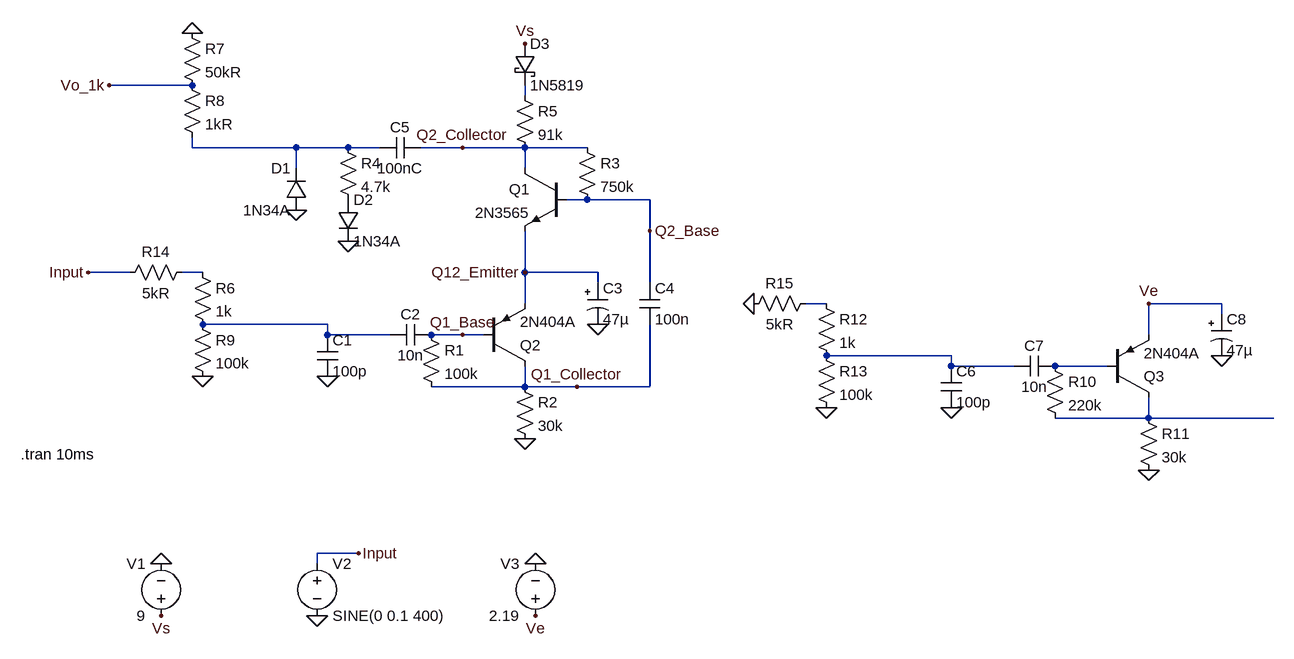
[diagram p0: schematic HarmonicPercolatorSine.asc]
HarmonicPercolatorSine.asc, the LTspice schematic file:
Version 4
SHEET 1 1720 1204
WIRE -48 -80 -176 -80
WIRE 464 -64 464 -80
WIRE -48 16 -48 0
WIRE 112 16 -48 16
WIRE 192 16 112 16
WIRE 240 16 192 16
WIRE 368 16 304 16
WIRE 464 16 368 16
WIRE 560 16 464 16
WIRE 112 48 112 16
WIRE 464 48 464 16
WIRE 560 96 528 96
WIRE 656 96 560 96
WIRE 656 144 656 96
WIRE -144 208 -208 208
WIRE -32 208 -64 208
WIRE 464 208 464 144
WIRE 576 208 464 208
WIRE 576 224 576 208
WIRE 656 224 656 144
WIRE 464 256 464 208
WIRE 928 256 896 256
WIRE 1536 256 1424 256
WIRE 1536 272 1536 256
WIRE 160 288 -32 288
WIRE 160 304 160 288
WIRE 256 304 160 304
WIRE 368 304 320 304
WIRE 400 304 368 304
WIRE 1424 304 1424 256
WIRE 1120 336 928 336
WIRE 1120 352 1120 336
WIRE 1216 352 1120 352
WIRE 1360 352 1280 352
WIRE 464 384 464 352
WIRE 464 384 320 384
WIRE 544 384 464 384
WIRE 656 384 656 288
WIRE 656 384 544 384
WIRE 1424 432 1424 400
WIRE 1424 432 1280 432
WIRE 1616 432 1424 432
WIRE 208 640 144 640
WIRE 144 656 144 640
FLAG 160 368 0
FLAG 464 464 0
FLAG 576 288 0
FLAG 192 160 0
FLAG 112 112 0
FLAG 368 304 Q1_Base
FLAG 544 384 Q1_Collector
FLAG 464 208 Q12_Emitter
FLAG 656 144 Q2_Base
FLAG 368 16 Q2_Collector
FLAG -96 656 0
FLAG -32 368 0
FLAG -48 -160 0
FLAG 144 736 0
FLAG 208 640 Input
FLAG -208 208 Input
FLAG -96 736 Vs
FLAG 464 -144 Vs
FLAG -176 -80 Vo_1k
FLAG 1120 416 0
FLAG 1424 512 0
FLAG 1536 336 0
FLAG 928 416 0
FLAG 480 656 0
FLAG 480 736 Ve
FLAG 1424 256 Ve
FLAG 816 256 0
SYMBOL cap 144 304 R0
SYMATTR InstName C1
SYMATTR Value 100p
SYMBOL cap 320 288 R90
WINDOW 0 0 32 VBottom 2
WINDOW 3 32 32 VTop 2
SYMATTR InstName C2
SYMATTR Value 10n
SYMBOL res 304 288 R0
SYMATTR InstName R1
SYMATTR Value 100k
SYMBOL res 448 368 R0
SYMATTR InstName R2
SYMATTR Value 30k
SYMBOL polcap 560 224 R0
SYMATTR InstName C3
SYMATTR Value 47µ
SYMBOL cap 640 224 R0
SYMATTR InstName C4
SYMATTR Value 100n
SYMBOL res 544 0 R0
SYMATTR InstName R3
SYMATTR Value 750k
SYMBOL diode 128 112 R180
WINDOW 0 24 64 Left 2
WINDOW 3 24 0 Left 2
SYMATTR InstName D1
SYMATTR Value 1N34A
SYMBOL res 176 0 R0
SYMATTR InstName R4
SYMATTR Value 4.7k
SYMBOL diode 176 96 R0
SYMATTR InstName D2
SYMATTR Value 1N34A
SYMBOL res 448 -80 R0
SYMATTR InstName R5
SYMATTR Value 91k
SYMBOL npn 528 48 M0
SYMATTR InstName Q1
SYMATTR Value 2N3565
SYMBOL schottky 448 -144 R0
SYMATTR InstName D3
SYMATTR Value 1N5819
SYMATTR Description Diode
SYMATTR Type diode
SYMBOL pnp 400 352 M180
SYMATTR InstName Q2
SYMATTR Value 2N404A
SYMBOL cap 304 0 R90
WINDOW 0 0 32 VBottom 2
WINDOW 3 32 32 VTop 2
SYMATTR InstName C5
SYMATTR Value 100nC
SYMBOL res -48 192 R0
SYMATTR InstName R6
SYMATTR Value 1k
SYMBOL res -64 -176 R0
SYMATTR InstName R7
SYMATTR Value 50kR
SYMBOL res -64 -96 R0
SYMATTR InstName R8
SYMATTR Value 1kR
SYMBOL voltage -96 752 R180
WINDOW 0 24 96 Left 2
WINDOW 3 24 16 Left 2
WINDOW 123 0 0 Left 0
WINDOW 39 0 0 Left 0
SYMATTR InstName V1
SYMATTR Value 9
SYMBOL res -48 272 R0
SYMATTR InstName R9
SYMATTR Value 100k
SYMBOL voltage 144 640 R0
WINDOW 123 0 0 Left 0
WINDOW 39 0 0 Left 0
SYMATTR InstName V2
SYMATTR Value SINE(0 0.1 400)
SYMBOL cap 1104 352 R0
SYMATTR InstName C6
SYMATTR Value 100p
SYMBOL cap 1280 336 R90
WINDOW 0 0 32 VBottom 2
WINDOW 3 32 32 VTop 2
SYMATTR InstName C7
SYMATTR Value 10n
SYMBOL res 1264 336 R0
SYMATTR InstName R10
SYMATTR Value 220k
SYMBOL res 1408 416 R0
SYMATTR InstName R11
SYMATTR Value 30k
SYMBOL polcap 1520 272 R0
SYMATTR InstName C8
SYMATTR Value 47µ
SYMBOL pnp 1360 400 M180
SYMATTR InstName Q3
SYMATTR Value 2N404A
SYMBOL res 912 240 R0
SYMATTR InstName R12
SYMATTR Value 1k
SYMBOL res 912 320 R0
SYMATTR InstName R13
SYMATTR Value 100k
SYMBOL res -48 192 R90
WINDOW 0 0 56 VBottom 2
WINDOW 3 32 56 VTop 2
SYMATTR InstName R14
SYMATTR Value 5kR
SYMBOL voltage 480 752 R180
WINDOW 0 24 96 Left 2
WINDOW 3 24 16 Left 2
WINDOW 123 0 0 Left 0
WINDOW 39 0 0 Left 0
SYMATTR InstName V3
SYMATTR Value 2.19
SYMBOL res 912 240 R90
WINDOW 0 0 56 VBottom 2
WINDOW 3 32 56 VTop 2
SYMATTR InstName R15
SYMATTR Value 5kR
TEXT -312 488 Left 2 !.tran 10ms

The netlist it stands for:
* HarmonicPercolatorSine.asc
C1 N005 0 100p
C2 Q1_Base N005 10n
R1 Q1_Base Q1_Collector 100k
R2 Q1_Collector 0 30k
C3 Q12_Emitter 0 47µ
C4 Q2_Base Q1_Collector 100n
R3 Q2_Collector Q2_Base 750k
D1 0 N002 1N34A
R4 N002 P001 4.7k
D2 P001 0 1N34A
R5 N001 Q2_Collector 91k
Q1 Q2_Collector Q2_Base Q12_Emitter 0 2N3565
D3 Vs N001 1N5819
Q2 Q1_Collector Q1_Base Q12_Emitter 0 2N404A
C5 Q2_Collector N002 100nC
R6 N003 N005 1k
R7 0 Vo_1k 50kR
R8 Vo_1k N002 1kR
V1 Vs 0 9
R9 N005 0 100k
V2 Input 0 SINE(0 0.1 400)
C6 N006 0 100p
C7 N007 N006 10n
R10 N007 N008 220k
R11 N008 0 30k
C8 Ve 0 47µ
Q3 N008 N007 Ve 0 2N404A
R12 N004 N006 1k
R13 N006 0 100k
R14 N003 Input 5kR
V3 Ve 0 2.19
R15 N004 0 5kR
.model D D
.lib standard.dio
.model NPN NPN
.model PNP PNP
.lib standard.bjt
.tran 10ms
.backanno
.end